# EAGLE design RGBWstrip (EAGLE 9.6.2)
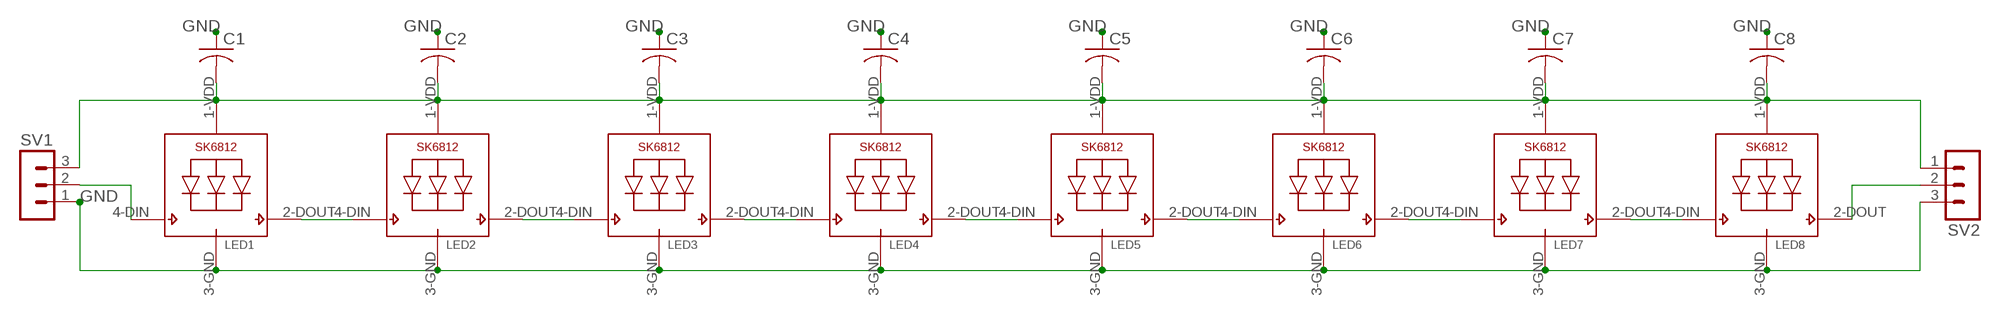
[diagram p0: schematic, sheet 1]

## Parts
C1  C-USC0805  [C0805]
C2  C-USC0805  [C0805]
C3  C-USC0805  [C0805]
C4  C-USC0805  [C0805]
C5  C-USC0805  [C0805]
C6  C-USC0805  [C0805]
C7  C-USC0805  [C0805]
C8  C-USC0805  [C0805]
LED1  SK6812_5050W  [LED5050_W]
LED2  SK6812_5050W  [LED5050_W]
LED3  SK6812_5050W  [LED5050_W]
LED4  SK6812_5050W  [LED5050_W]
LED5  SK6812_5050W  [LED5050_W]
LED6  SK6812_5050W  [LED5050_W]
LED7  SK6812_5050W  [LED5050_W]
LED8  SK6812_5050W  [LED5050_W]
SV1  MA03-1  [MA03-1]
SV2  MA03-1  [MA03-1]

## Nets
GND: C1.1 C2.1 C3.1 C4.1 C5.1 C6.1 C7.1 C8.1 LED1.3-GND(GND) LED2.3-GND(GND) LED3.3-GND(GND) LED4.3-GND(GND) LED5.3-GND(GND) LED6.3-GND(GND) LED7.3-GND(GND) LED8.3-GND(GND) SV1.1 SV2.3
N$1: LED1.4-DIN(DI) SV1.2
N$2: C1.2 C2.2 C3.2 C4.2 C5.2 C6.2 C7.2 C8.2 LED1.1-VDD(VDD) LED2.1-VDD(VDD) LED3.1-VDD(VDD) LED4.1-VDD(VDD) LED5.1-VDD(VDD) LED6.1-VDD(VDD) LED7.1-VDD(VDD) LED8.1-VDD(VDD) SV1.3 SV2.1
N$3: LED8.2-DOUT(DO) SV2.2
N$4: LED1.2-DOUT(DO) LED2.4-DIN(DI)
N$5: LED2.2-DOUT(DO) LED3.4-DIN(DI)
N$6: LED3.2-DOUT(DO) LED4.4-DIN(DI)
N$7: LED4.2-DOUT(DO) LED5.4-DIN(DI)
N$8: LED5.2-DOUT(DO) LED6.4-DIN(DI)
N$9: LED6.2-DOUT(DO) LED7.4-DIN(DI)
N$10: LED7.2-DOUT(DO) LED8.4-DIN(DI)

## Library data of the parts
C1-C8 = rcl:C-US: CAPACITOR, American symbol; SPICEPREFIX: C
LED1-LED8 = SK6812:SK6812
SV1 SV2 = con-lstb:MA03-1: PIN HEADER; OC_FARNELL: unknown; OC_NEWARK: unknown

## Board
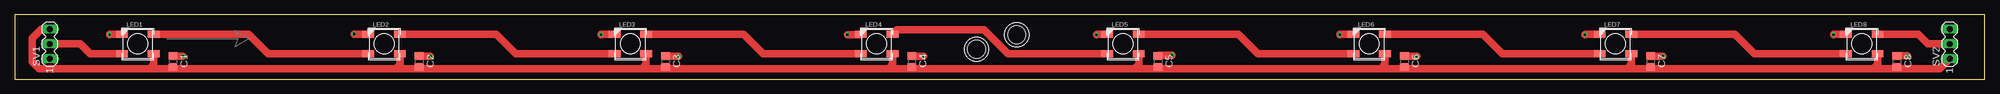
[diagram p1: board, top side]
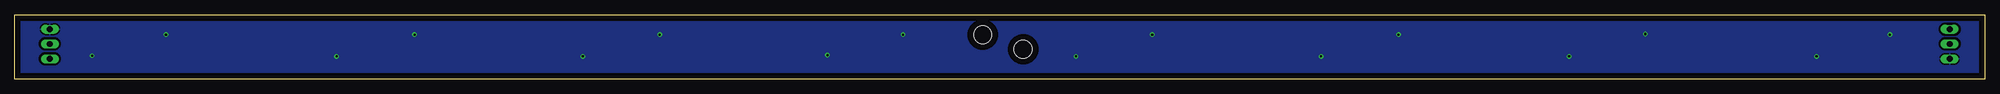
[diagram p2: board, bottom side, seen from below]

Size 336 x 11 mm. Coordinates in mm from the lower left corner, seen from the top.
Outline: 0,0 336,0 336,11 0,11 0,0
Copper layers (1*16): Top 0.035mm / dielectric 1.5mm / Bottom 0.035mm
Design rules "ACES_THT": minimum track width 18mil, minimum drill 0.35mm, track to track 10mil, track to pad 10mil, pad to pad 10mil, via to via 10mil, smd to smd 6mil, copper to edge 40mil, drill to drill 6mil, minimum pad ring 10mil, minimum via ring 8mil, stop-mask expansion 4mil, vias tented up to drill 0mil, thermal gap 10mil

### Footprints (pad centres in the part's own frame; a part is rotated, then mirrored left to right if it is on the bottom)
C0805 = smd 1.3 x 1.5: 1 -0.95,0; 2 0.95,0
LED5050_W = smd 2 x 1.2: 1-VDD 2.7,-1.65; 2-DOUT 2.7,1.65; 3-GND -2.7,1.65; 4-DIN -2.7,-1.65
MA03-1 = drill 1.016 long: 1 -2.54,0; 2 0,0; 3 2.54,0
MOUNTINGHOLE_3.2MM_PLATEDTHIN = hole 3.1: 0,0

### Placement (x,y rotation side)
C1  27,3 270 top
C2  69,3 270 top
C3  111,3 270 top
C4  153,3 270 top
C5  195,3 270 top
C6  237,3 270 top
C7  279,3 270 top
C8  321,3 270 top
LED1  21,6 0 top
LED2  63,6 0 top
LED3  105,6 0 top
LED4  147,6 0 top
LED5  189,6 0 top
LED6  231,6 0 top
LED7  273,6 0 top
LED8  315,6 0 top
SV1  6,6 90 top
SV2  330,6 90 top
U$2  [MOUNTINGHOLE_3.2MM_PLATEDTHIN]  164,5.1 0 top
U$3  [MOUNTINGHOLE_3.2MM_PLATEDTHIN]  170.9,7.6 0 top

### Tracks (layer width: path | path; a pad name or v marks a point on that pad's centre or on a via)
GND  (via drill 0.35)
  Top 1.27: C1.1 28.65,3.95 v28.7,3.9 | LED1.3-GND 16.25,7.65 v16.2,7.6 | LED2.3-GND 57.95,7.65 v57.9,7.7 | C2.1 70.85,3.95 v70.9,3.9 | LED3.3-GND 100.05,7.65 v100,7.6 | C3.1 113.15,3.95 v113.2,3.9 | LED4.3-GND 144.25,7.6 v142,7.6 | C4.1 154.95,3.95 v155,3.9 | LED5.3-GND 184.55,7.65 v184.5,7.6 | C5.1 195.15,4.1 v197.4,4.1 | LED6.3-GND 226.05,7.65 v226,7.6 | C6.1 239.05,3.95 v239.1,3.9 | LED7.3-GND 267.85,7.65 v267.8,7.6 | C7.1 281.05,3.95 v281.1,3.9 | LED8.3-GND 310.25,7.65 v310.2,7.6 | C8.1 321.05,4 v322.8,4
  pour Bottom (isolate 0.406): 0,11 0,0 336,0 336,11
N$1
  Top 1.27: SV1.2 11.2,6 12.85,4.35 LED1.4-DIN
N$2
  Top 0.457: C1.2 27,1.81 | C2.2 69,1.81
  Top 1.27: SV1.3 4.54,8.54 3,7 3,3 4.19,1.81 23,1.81 | SV2.1 328.35,1.81 320.76,1.81 | 23,1.81 27,1.81 65,1.81 | 65,1.81 69,1.81 107,1.81 | 107,1.81 111,1.81 | 111,1.81 149,1.81 | 149,1.81 152.76,1.81 | 152.76,1.81 191,1.81 | 191,1.81 194.76,1.81 | 194.76,1.81 233,1.81 | 233,1.81 236.76,1.81 | 236.76,1.81 275,1.81 | 275,1.81 278.76,1.81 | 278.76,1.81 317,1.81 | 317,1.81 320,1.81 320.76,1.81 | 24,4.05 LED1.1-VDD 23.7,2.51 23,1.81 | LED2.1-VDD 65.7,2.51 65,1.81 | LED3.1-VDD 107.7,2.51 107,1.81 | LED4.1-VDD 149.7,2.51 149,1.81 | LED5.1-VDD 191.7,2.51 191,1.81 | LED6.1-VDD 233.7,2.51 233,1.81 | LED7.1-VDD 275.7,2.51 275,1.81 | LED8.1-VDD 317.7,2.51 317,1.81 | C3.2 111,1.81 | C4.2 152.76,1.81 | C5.2 194.76,1.81 | C6.2 236.76,1.81 | C7.2 278.76,1.81 | C8.2 320.76,1.81
N$3
  Top 1.27: LED8.2-DOUT 324.65,7.65 326.3,6 SV2.2
N$4
  Top 1.27: LED1.2-DOUT 39.9,7.65 43.2,4.35 LED2.4-DIN
N$5
  Top 1.27: LED2.2-DOUT 82.1,7.65 85.4,4.35 LED3.4-DIN
N$6
  Top 1.27: LED3.2-DOUT 124.3,7.65 127.6,4.35 LED4.4-DIN
N$7
  Top 1.27: LED4.2-DOUT 150.5,8.45 165.3,8.45 169.4,4.35 LED5.4-DIN
N$8
  Top 1.27: LED5.2-DOUT 208.7,7.65 212,4.35 LED6.4-DIN
N$9
  Top 1.27: LED6.2-DOUT 250.4,7.65 253.7,4.35 LED7.4-DIN
N$10
  Top 1.27: LED7.2-DOUT 293.4,7.65 296.7,4.35 LED8.4-DIN

### Text on the board
tDocu: 5V | GND | IN | OUT | GND | 5V
bDocu: Xander Chin - Ping pong LED matrix v1.0 / LED strip